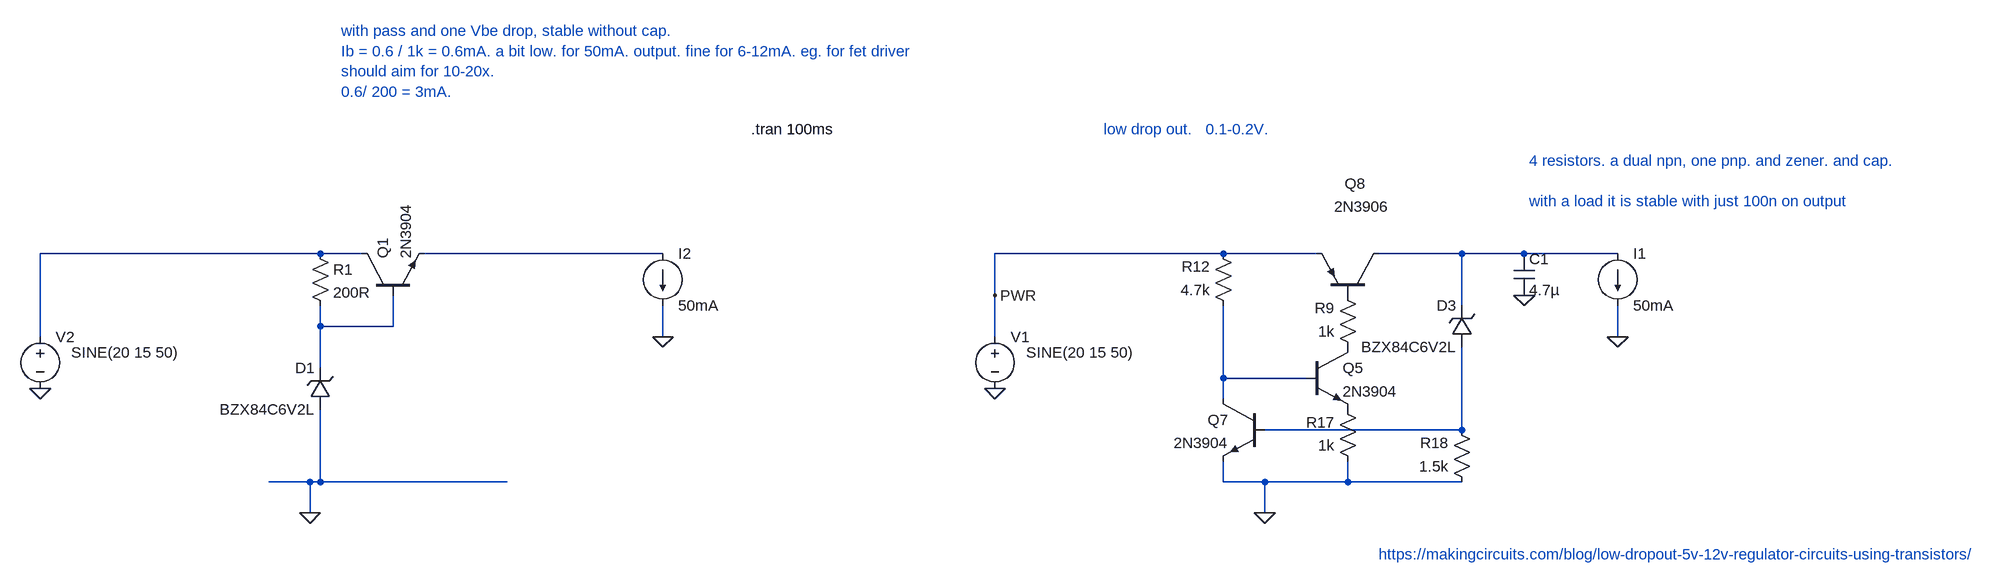
[diagram p0: schematic Draft05.asc]
Draft05.asc, the LTspice schematic file:
Version 4
SHEET 1 5720 1884
WIRE -832 -32 -1264 -32
WIRE -768 -32 -832 -32
WIRE -304 -32 -672 -32
WIRE 560 -32 208 -32
WIRE 704 -32 560 -32
WIRE 928 -32 800 -32
WIRE 1024 -32 928 -32
WIRE 1168 -32 1024 -32
WIRE 208 32 208 -32
WIRE 928 48 928 -32
WIRE -832 80 -832 48
WIRE -720 80 -720 32
WIRE -720 80 -832 80
WIRE -1264 96 -1264 -32
WIRE -304 96 -304 48
WIRE 208 96 208 32
WIRE 1168 96 1168 48
WIRE -832 144 -832 80
WIRE 560 160 560 48
WIRE 688 160 560 160
WIRE 560 192 560 160
WIRE 928 240 928 112
WIRE 928 240 624 240
WIRE -848 320 -912 320
WIRE -832 320 -832 208
WIRE -832 320 -848 320
WIRE -544 320 -832 320
WIRE 560 320 560 288
WIRE 624 320 560 320
WIRE 752 320 752 288
WIRE 752 320 624 320
WIRE 928 320 752 320
WIRE -848 368 -848 320
WIRE 624 368 624 320
FLAG 208 176 0
FLAG 208 32 PWR
FLAG 624 368 0
FLAG 1024 32 0
FLAG 1168 96 0
FLAG -1264 176 0
FLAG -848 368 0
FLAG -304 96 0
SYMBOL npn 688 112 R0
SYMATTR InstName Q5
SYMATTR Value 2N3904
SYMBOL voltage 208 80 R0
WINDOW 123 0 0 Left 0
WINDOW 39 0 0 Left 0
WINDOW 3 48 40 Left 2
SYMATTR Value SINE(20 15 50)
SYMATTR InstName V1
SYMBOL npn 624 192 M0
SYMATTR InstName Q7
SYMATTR Value 2N3904
SYMBOL res 768 128 R180
WINDOW 0 36 76 Left 2
WINDOW 3 36 40 Left 2
SYMATTR InstName R9
SYMATTR Value 1k
SYMBOL pnp 800 32 M270
WINDOW 0 172 53 VLeft 2
WINDOW 3 137 69 VLeft 2
SYMATTR InstName Q8
SYMATTR Value 2N3906
SYMBOL res 576 64 R180
WINDOW 0 36 76 Left 2
WINDOW 3 36 40 Left 2
SYMATTR InstName R12
SYMATTR Value 4.7k
SYMBOL res 768 304 R180
WINDOW 0 36 76 Left 2
WINDOW 3 36 40 Left 2
SYMATTR InstName R17
SYMATTR Value 1k
SYMBOL zener 944 112 R180
WINDOW 0 24 64 Left 2
WINDOW 3 24 0 Left 2
SYMATTR InstName D3
SYMATTR Value BZX84C6V2L
SYMATTR Description Diode
SYMATTR Type diode
SYMBOL res 944 336 R180
WINDOW 0 36 76 Left 2
WINDOW 3 36 40 Left 2
SYMATTR InstName R18
SYMATTR Value 1.5k
SYMBOL cap 1008 -32 R0
SYMATTR InstName C1
SYMATTR Value 4.7µ
SYMBOL current 1168 -32 R0
WINDOW 123 0 0 Left 0
WINDOW 39 0 0 Left 0
SYMATTR InstName I1
SYMATTR Value 50mA
SYMBOL voltage -1264 80 R0
WINDOW 123 0 0 Left 0
WINDOW 39 0 0 Left 0
WINDOW 3 48 40 Left 2
SYMATTR Value SINE(20 15 50)
SYMATTR InstName V2
SYMBOL zener -816 208 R180
WINDOW 0 24 64 Left 2
WINDOW 3 24 0 Left 2
SYMATTR InstName D1
SYMATTR Value BZX84C6V2L
SYMATTR Description Diode
SYMATTR Type diode
SYMBOL current -304 -32 R0
WINDOW 123 0 0 Left 0
WINDOW 39 0 0 Left 0
SYMATTR InstName I2
SYMATTR Value 50mA
SYMBOL res -848 -48 R0
SYMATTR InstName R1
SYMATTR Value 200R
SYMBOL npn -768 32 R270
SYMATTR InstName Q1
SYMATTR Value 2N3904
TEXT -168 -224 Left 2 !.tran 100ms
TEXT 1032 -176 Left 2 ;4 resistors. a dual npn, one pnp. and zener. and cap.\n \nwith a load it is stable with just 100n on output
TEXT 800 432 Left 2 ;https://makingcircuits.com/blog/low-dropout-5v-12v-regulator-circuits-using-transistors/
TEXT 376 -224 Left 2 ;low drop out.   0.1-0.2V.
TEXT -800 -376 Left 2 ;with pass and one Vbe drop, stable without cap.\nIb = 0.6 / 1k = 0.6mA. a bit low. for 50mA. output. fine for 6-12mA. eg. for fet driver\nshould aim for 10-20x.\n0.6/ 200 = 3mA.

The netlist it stands for:
* Draft05.asc
Q5 P001 N005 P002 0 2N3904
V1 PWR 0 SINE(20 15 50)
Q7 N005 N006 0 0 2N3904
R9 P001 P003 1k
Q8 N003 P003 PWR 0 2N3906
R12 N005 PWR 4.7k
R17 0 P002 1k
D3 N006 N003 BZX84C6V2L
R18 0 N006 1.5k
C1 N003 0 4.7µ
I1 N003 0 50mA
V2 N001 0 SINE(20 15 50)
D1 0 N004 BZX84C6V2L
I2 N002 0 50mA
R1 N001 N004 200R
Q1 N001 N004 N002 0 2N3904
.model D D
.lib standard.dio
.model NPN NPN
.model PNP PNP
.lib standard.bjt
.tran 100ms
* 4 resistors. a dual npn, one pnp. and zener. and cap.
* with a load it is stable with just 100n on output
* https://makingcircuits.com/blog/low-dropout-5v-12v-regulator-circuits-using-transistors/
* low drop out.   0.1-0.2V.
* with pass and one Vbe drop, stable without cap.
* Ib = 0.6 / 1k = 0.6mA. a bit low. for 50mA. output. fine for 6-12mA. eg. for fet driver
* should aim for 10-20x.
* 0.6/ 200 = 3mA.
.backanno
.end